# EAGLE design demo (EAGLE 6.5.0)
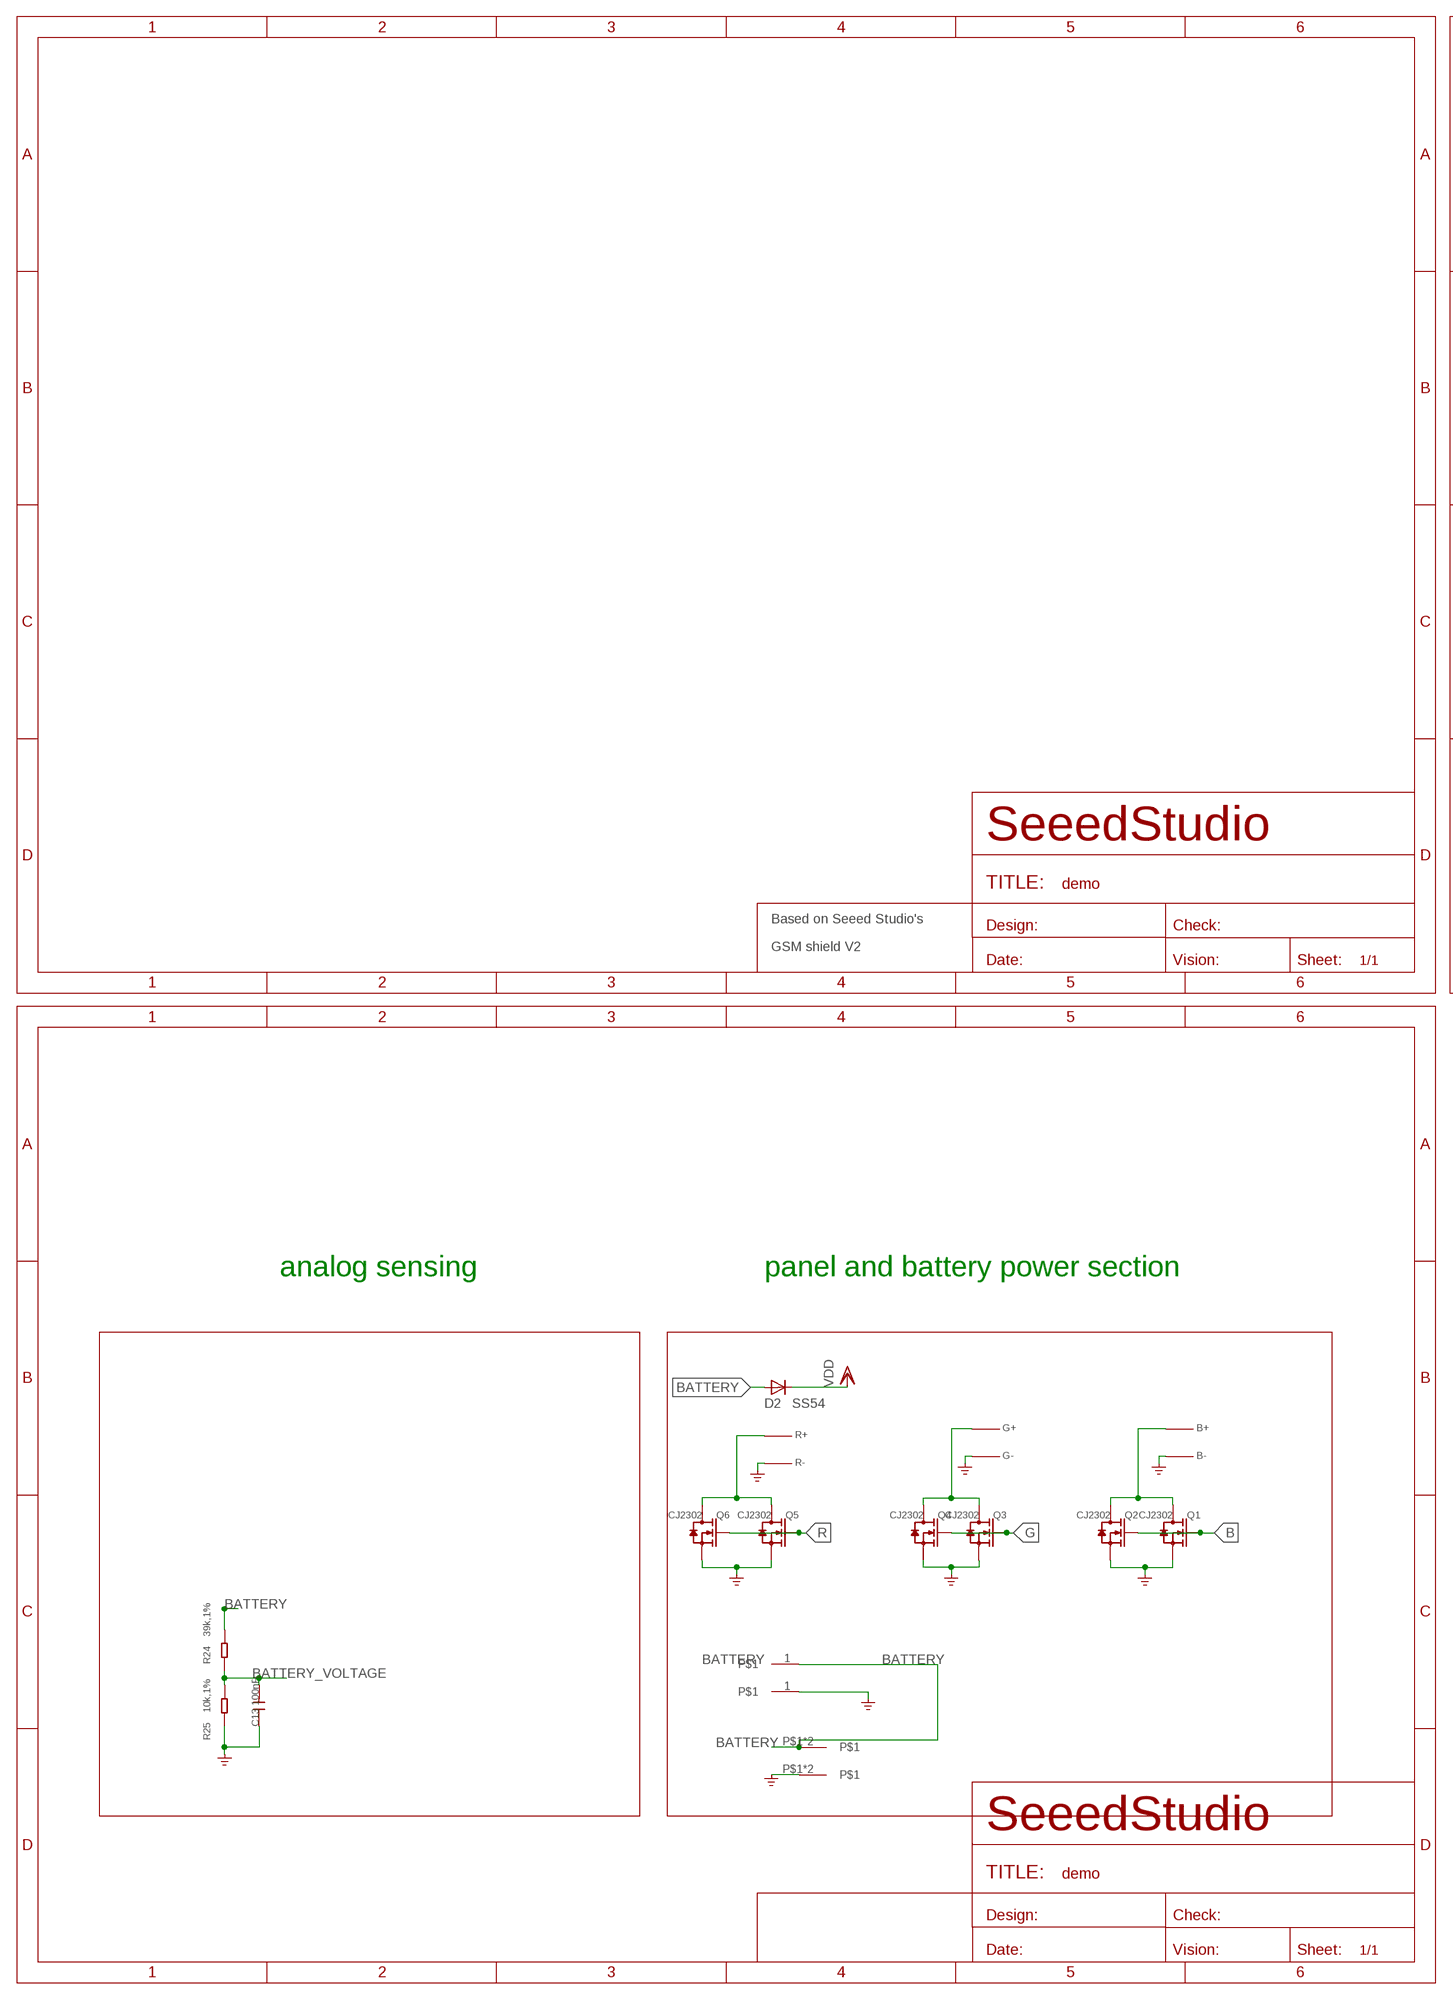
[diagram p0: schematic, sheet 1, part 1 of 2]
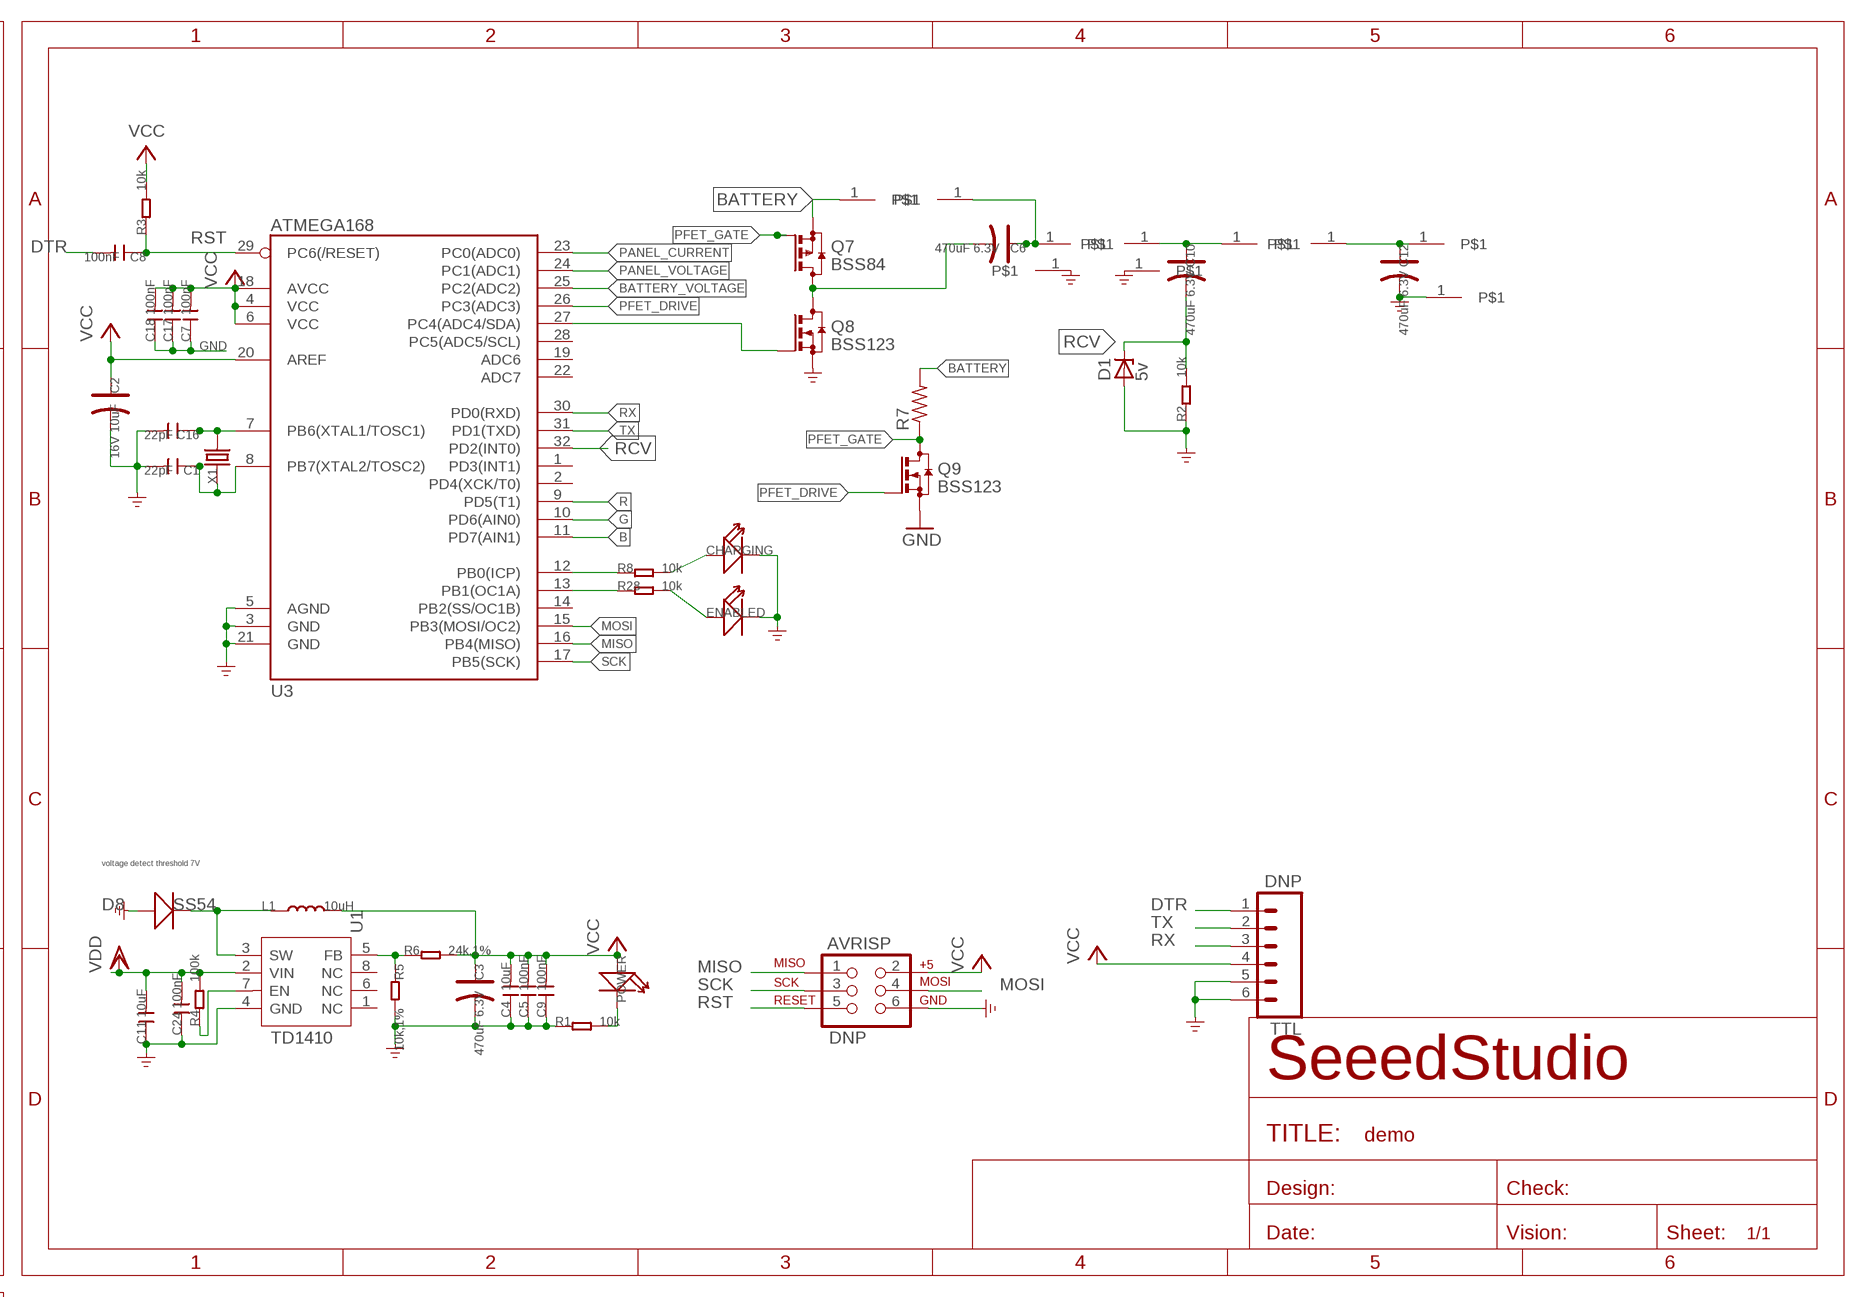
[diagram p1: schematic, sheet 1, part 2 of 2]

## Parts
AVRISP  DNP  AVR_SPI_PRG_62X3_LOCK  [2X3_LOCK]
B+  TINYPIPES_BATTSBATT  [TINYPIPES_SBATT]
B-  TINYPIPES_BATTSBATT  [TINYPIPES_SBATT]
BATTERY+  TINYPIPES_BATTBATT  [TINYPIPES_BATT]
BATTERY-  TINYPIPES_BATTBATT  [TINYPIPES_BATT]
C1  22pF  C-0603  [C0603]
C2  16V 10uF  CAP-AVX-A  [AVX-A]
C3  470uF 6.3V  CAP-AVX-D  [AVX-D]
C4  10uF  C-0805  [C0805]
C5  100nF  C-0603  [C0603]
C6  470uF 6.3V  CAP-AVX-D  [AVX-D]
C7  100nF  C-0603  [C0603]
C8  100nF  C-0603  [C0603]
C9  100nF  C-0603  [C0603]
C10  470uF 6.3V  CAP-AVX-D  [AVX-D]
C11  10uF  C-0805  [C0805]
C12  470uF 6.3V  CAP-AVX-D  [AVX-D]
C13  100nF  C-0603  [C0603]
C16  22pF  C-0603  [C0603]
C17  100nF  C-0603  [C0603]
C18  100nF  C-0603  [C0603]
C24  100nF  C-0603  [C0603]
CHARGING  LED'0603'  [LED-0603]
D1  5v  ZENER-DIODESOD80C  [SOD80C]
D2  SS54  DIODE-SMB  [SMB]
D8  SS54  D'MBRS240LT3'  [SMB]
ENABLED  LED'0603'  [LED-0603]
G+  TINYPIPES_BATTSBATT  [TINYPIPES_SBATT]
G-  TINYPIPES_BATTSBATT  [TINYPIPES_SBATT]
IN+  TINYPIPES_BATTBATT  [TINYPIPES_BATT]
IN-  TINYPIPES_BATTBATT  [TINYPIPES_BATT]
L1  10uH  L'0630'  [L0630]
L1+  TINYPIPES_BATTBATT  [TINYPIPES_BATT]
L1-  TINYPIPES_BATTBATT  [TINYPIPES_BATT]
L2+  TINYPIPES_BATTBATT  [TINYPIPES_BATT]
L2-  TINYPIPES_BATTBATT  [TINYPIPES_BATT]
LOAD+  TINYPIPES_BATTBATT  [TINYPIPES_BATT]
LOAD-  TINYPIPES_BATTBATT  [TINYPIPES_BATT]
OUT+  TINYPIPES_BATTBATT  [TINYPIPES_BATT]
OUT-  TINYPIPES_BATTBATT  [TINYPIPES_BATT]
PANEL+  TINYPIPES_BATTPANEL  [TINYPIPES_PANEL]
PANEL-  TINYPIPES_BATTPANEL  [TINYPIPES_PANEL]
POWER  LED'0603'  [LED-0603]
Q1  CJ2302  MOSFET-N'SOT23'  [SOT23]
Q2  CJ2302  MOSFET-N'SOT23'  [SOT23]
Q3  CJ2302  MOSFET-N'SOT23'  [SOT23]
Q4  CJ2302  MOSFET-N'SOT23'  [SOT23]
Q5  CJ2302  MOSFET-N'SOT23'  [SOT23]
Q6  CJ2302  MOSFET-N'SOT23'  [SOT23]
Q7  BSS84  [SOT23]
Q8  BSS123  [SOT23]
Q9  BSS123  [SOT23]
R1  10k  R-0603  [R0603]
R2  10k  R-0603  [R0603]
R3  10k  R-0603  [R0603]
R4  100k  R-0603  [R0603]
R5  10k,1%  R-0603  [R0603]
R6  24k,1%  R-0603  [R0603]
R7  R-US_R0603  [R0603]
R8  10k  R-0603  [R0603]
R24  39k,1%  R-0603  [R0603]
R25  10k,1%  R-0603  [R0603]
R28  10k  R-0603  [R0603]
R+  TINYPIPES_BATTSBATT  [TINYPIPES_SBATT]
R-  TINYPIPES_BATTSBATT  [TINYPIPES_SBATT]
TTL  DNP  M06LOCK  [1X06_LOCK]
U1  TD1410  [SOP8]
U3  ATMEGA168  [TQFP32-08]
X1  CRYSTAL'5032'  [2P-SMD-5X3.2]

## Nets
B: Q1.1(G) Q2.1(G) U3.11(PD7(AIN1))
BATTERY [power]: BATTERY+.1 D2.A L1+.1 PANEL+.P$1 PANEL+.P$2 Q7.2(S) R7.2 R24.2
BATTERY1 [power]: C10.+ IN+.1 L2+.1
BATTERY_VOLTAGE: C13.2 R24.1 R25.2 U3.25(PC2(ADC2))
DTR: C8.2 TTL.1
G: Q3.1(G) Q4.1(G) U3.10(PD6(AIN0))
GND: AVRISP.6 B-.P$1 BATTERY-.1 C1.2 C2.- C3.- C4.1 C5.1 C7.1 C9.1 C11.1 C12.- C13.1 C16.2 C17.1 C18.1 C24.1 CHARGING.- D1.A D8.+ ENABLED.- G-.P$1 IN-.1 LOAD-.1 OUT-.1 PANEL-.P$1 PANEL-.P$2 Q1.2(S) Q2.2(S) Q3.2(S) Q4.2(S) Q5.2(S) Q6.2(S) Q8.2(S) Q9.2(S) R1.1 R2.1 R5.2 R25.1 R-.P$1 TTL.5 TTL.6 U1.4(GND) U3.3(GND) U3.5(AGND) U3.21(GND)
MISO: AVRISP.1 U3.16(PB4(MISO))
MOSI: AVRISP.4 U3.15(PB3(MOSI/OC2))
N$1: C6.- Q7.3(D) Q8.3(D)
N$2: C16.1 U3.7(PB6(XTAL1/TOSC1)) X1.2
N$3: B+.P$1 Q1.3(D) Q2.3(D)
N$4: Q8.1(G) U3.27(PC4(ADC4/SDA))
N$6: G+.P$1 Q3.3(D) Q4.3(D)
N$7: Q5.3(D) Q6.3(D) R+.P$1
N$8: C6.+ L1-.1 OUT+.1
N$9: POWER.- R1.2
N$10 [power]: R8.1 U3.12(PB0(ICP))
N$12: R4.1 U1.7(EN)
N$13: C1.1 U3.8(PB7(XTAL2/TOSC2)) X1.1
N$14 [power]: R28.1 U3.13(PB1(OC1A))
N$15: C12.+ L2-.1 LOAD+.1
N$18: CHARGING.+ R8.2
N$24: ENABLED.+ R28.2
N$38: D8.- L1.1 U1.3(SW)
N$47: R5.1 R6.1 U1.5(FB)
PANEL_CURRENT: U3.23(PC0(ADC0))
PANEL_VOLTAGE: U3.24(PC1(ADC1))
PFET_DRIVE: Q9.1(G) U3.26(PC3(ADC3))
PFET_GATE: Q7.1(G) Q9.3(D) R7.1
R: Q5.1(G) Q6.1(G) U3.9(PD5(T1))
RCV: C10.- D1.C R2.2 U3.32(PD2(INT0))
RST: AVRISP.5 C8.1 R3.1 U3.29(PC6(/RESET))
RX: TTL.3 U3.30(PD0(RXD))
SCK: AVRISP.3 U3.17(PB5(SCK))
TX: TTL.2 U3.31(PD1(TXD))
VCC: AVRISP.2 C2.+ C3.+ C4.2 C5.2 C7.2 C9.2 C17.2 C18.2 L1.2 POWER.+ R3.2 R6.2 TTL.4 U3.4(VCC) U3.6(VCC) U3.18(AVCC) U3.20(AREF)
VDD: C11.2 C24.2 D2.C R4.2 U1.2(VIN)
Unconnected: U1.1(NC) U1.6(NC) U1.8(NC) U3.1(PD3(INT1)) U3.2(PD4(XCK/T0)) U3.14(PB2(SS/OC1B)) U3.19(ADC6) U3.22(ADC7) U3.28(PC5(ADC5/SCL))

## Notes on the sheet
- voltage detect threshold 7V
- Based on Seeed Studio's
- GSM shield V2
- analog sensing | panel and battery power section

## Library data of the parts
AVRISP = SparkFun:AVR_SPI_PRG_6: AVR ISP 6 Pin This is the reduced ISP connector for AVR programming. Common on Arduino. This footprint will take up less PCB space and can be used with a 10-pin to 6-pin adapter such as SKU: BOB-08508
B+ B- G+ G- R+ R- = demo:TINYPIPES_BATT
BATTERY+ BATTERY- IN+ IN- L1+ L1- L2+ L2- LOAD+ LOAD- OUT+ OUT- PANEL+ PANEL- = tinyPipes_v2.5:TINYPIPES_BATT
C1 C4 C5 C7-C9 C11 C13 C16-C18 C24 = Discrete:C*: Ceramic Capacitors
C2 C3 C6 C10 C12 = Discrete:CAP*: Electrolytic Capacitors,Tantalum Capacitors and Super Capacitors
CHARGING ENABLED POWER = Discrete:LED*
D1 = diode:ZENER-DIODE: Z-Diode
D2 = diode:DIODE-: DIODE
D8 = Discrete:D*
L1 = Discrete:L*
Q1-Q6 = Discrete:MOSFET-N: IRLL014: http://www.vishay.com/docs/91319/sihll014.pdf
Q7 = transistor-small-signal:BSS84: P-CHANNEL MOS FET
Q8 Q9 = transistor-small-signal:BSS123: N-CHANNEL MOS FET
R1-R6 R8 R24 R25 R28 = Discrete:R*
R7 = rcl:R-US_: RESISTOR, American symbol
TTL = SparkFun-Connectors:M06: Header 6 Standard 6-pin 0.1" header. Use with straight break away headers (SKU : PRT-00116), right angle break away headers (PRT-00553), swiss pins (PRT-00743), machine pins (PRT-00117), and female headers (PRT-00115). Molex polarized connector foot print use with SKU : PRT-08094 with associated crimp pins and housings. NOTES ON THE VARIANTS LOCK and LOCK_LONGPADS... This footprint was designed to help hold the alignment of a through-hole component (i.e. 6-pin header) while soldering it into place. You may notice that each hole has been shifted either up or down by 0.005 of an inch from it's more standard position (which is a perfectly straight line). This slight alteration caused the pins (the squares in the middle) to touch the edges of the holes. Because they are alternating, it causes a "brace" to hold the component in place. 0.005 has proven to be the perfect amount of "off-center" position when using our standard breakaway headers. Although looks a little odd when you look at the bare footprint, once you have a header in there, the alteration is very hard to notice. Also,if you push a header all the way into place, it is covered up entirely on the bottom side. This idea of altering the position of holes to aid alignment will be further integrated into the Sparkfun Library for other footprints. It can help hold any component with 3 or more connection pins.
U1 = template:TD1410: 2A 380KHz 20V PWM Buck DC/DC Converter
U3 = SparkFun:ATMEGA168
X1 = Discrete:CRYSTAL*: CRYSTAL

## Board
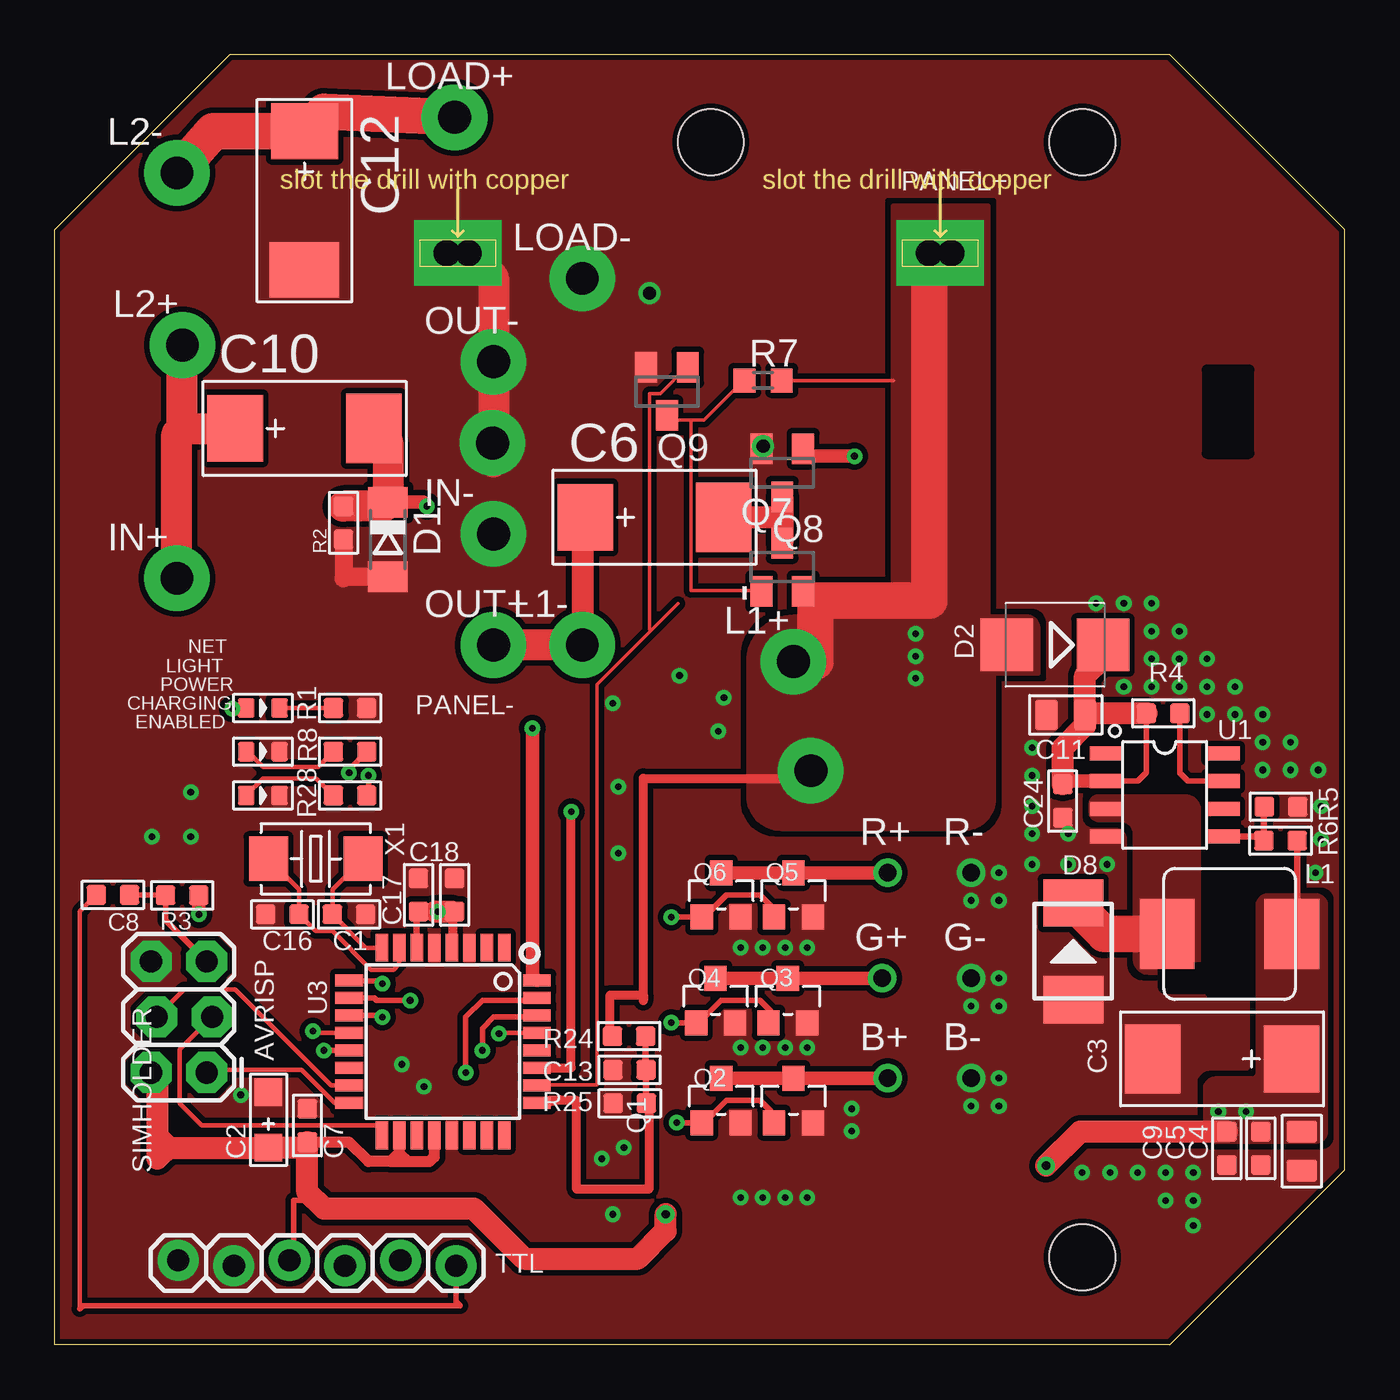
[diagram p2: board, top side]
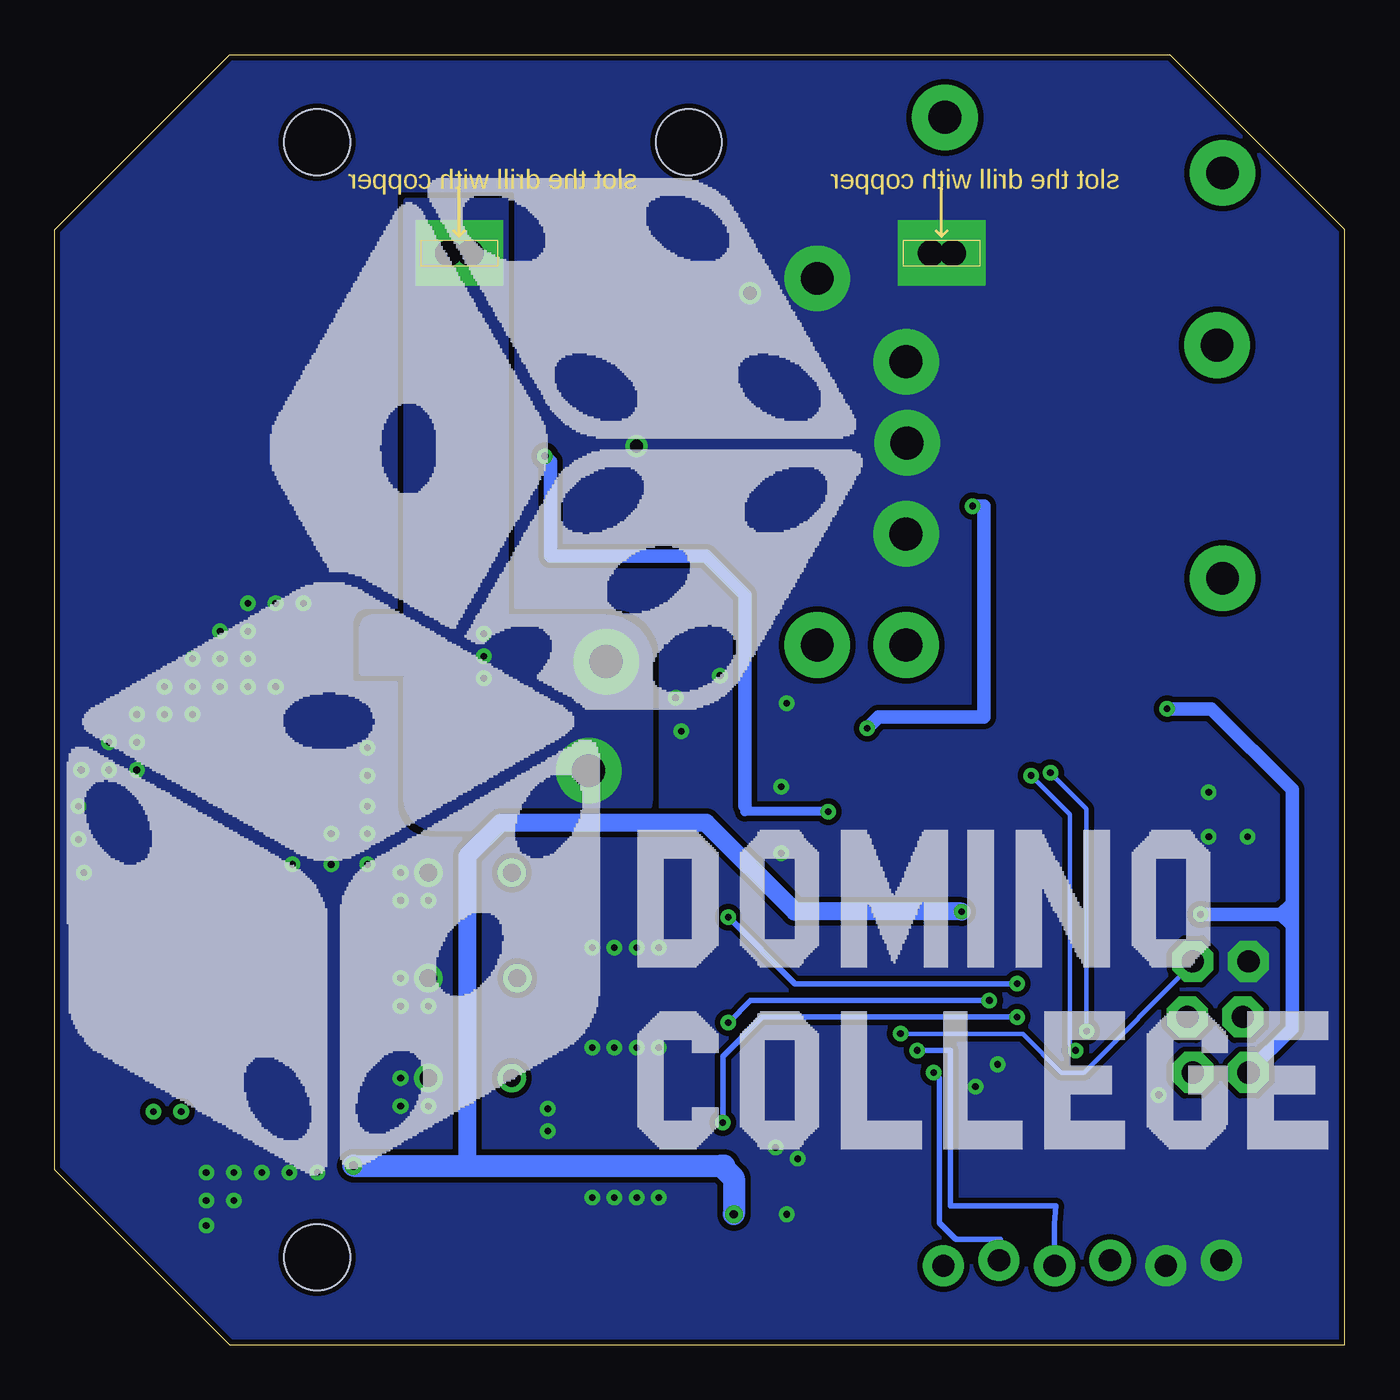
[diagram p3: board, bottom side, seen from below]

Size 59 x 59 mm. Coordinates in mm from the lower left corner, seen from the top.
Outline: 51,0 0,0 0,51 8,59 51,59 59,51 59,8 51,0
Copper layers (1*16): Top 0.035mm / dielectric 1.5mm / Bottom 0.035mm
Design rules "default *": minimum track width 6mil, minimum drill 12mil, track to track 6mil, track to pad 6mil, pad to pad 6mil, via to via 6mil, smd to smd 0mil, copper to edge 10mil, drill to drill 8mil, minimum pad ring 10mil, minimum via ring 8mil, stop-mask expansion 4mil, vias tented up to drill 0.7mm, thermal gap 10mil
Holes 3 mm at 47,4 47,55 30,55
tRestrict: area 52.7,40.8 to 54.6,44.6; 8 lines

### Footprints (pad centres in the part's own frame; a part is rotated, then mirrored left to right if it is on the bottom)
2X3_LOCK = drill 1.016 pad 1.88 octagon: 1 0,0; 2 0,2.54; 3 2.54,-0.254; 4 2.54,2.286; 5 5.08,0; 6 5.08,2.54
TINYPIPES_SBATT = drill 0.8: P$1 0,0
TINYPIPES_BATT = drill 1.5 pad 3: 1 0,0
C0603 = smd 0.889 x 0.889: 1 -0.762,0; 2 0.762,0
AVX-A = smd 1.27 x 1.27: + -1.27,0; - 1.27,0
AVX-D = smd 2.54 x 3.048: + -3.175,0 | smd 2.54 x 3.175: - 3.175,0
C0805 = smd 1.016 x 1.397: 1 -0.889,0; 2 0.889,0
LED-0603 = smd 0.762 x 0.889: + -0.762,0; - 0.762,0
SOD80C = smd 1.4 x 1.8: A 1.7,0; C -1.7,0
SMB = smd 2.4 x 2.4: A 2.2,0; C -2.2,0
SMB' = smd 2.159 x 2.743: + -2.21,0; - 2.21,0
L0630 = smd 2.5 x 3.2: 1 -2.85,0; 2 2.85,0
TINYPIPES_PANEL = drill 1.2 pad 3 square: P$1 -0.492,0; P$2 0.508,0
SOT23 = smd 1.016 x 1.143: 1 -0.889,-1.016; 2 0.889,-1.016; 3 0,1.016
SOT23' = smd 1 x 1.4: 1 -0.95,-1.1; 2 0.95,-1.1; 3 0,1.1
R0603 = smd 0.889 x 0.889: 1 -0.762,0; 2 0.762,0
R0603' = smd 1 x 1.1: 1 -0.85,0; 2 0.85,0
1X06_LOCK = drill 1.016 pad 1.88: 1 0,0; 2 2.54,-0.254; 3 5.08,0; 4 7.62,-0.254; 5 10.16,0; 6 12.7,-0.254
SOP8 = smd 0.635 x 1.524: 1 -1.905,-2.667; 2 -0.635,-2.667; 3 0.635,-2.667; 4 1.905,-2.667; 5 1.905,2.667; 6 0.635,2.667; 7 -0.635,2.667; 8 -1.905,2.667
TQFP32-08 = smd 1.27 x 0.559: 1 -4.293,2.8; 2 -4.293,2; 3 -4.293,1.2; 4 -4.293,0.4; 5 -4.293,-0.4; 6 -4.293,-1.2; 7 -4.293,-2; 8 -4.293,-2.8; 17 4.293,-2.8; 18 4.293,-2; 19 4.293,-1.2; 20 4.293,-0.4; 21 4.293,0.4; 22 4.293,1.2; 23 4.293,2; 24 4.293,2.8 | smd 0.559 x 1.27: 9 -2.8,-4.293; 10 -2,-4.293; 11 -1.2,-4.293; 12 -0.4,-4.293; 13 0.4,-4.293; 14 1.2,-4.293; 15 2,-4.293; 16 2.8,-4.293; 25 2.8,4.293; 26 2,4.293; 27 1.2,4.293; 28 0.4,4.293; 29 -0.4,4.293; 30 -1.2,4.293; 31 -2,4.293; 32 -2.8,4.293
2P-SMD-5X3.2 = smd 1.778 x 2.032: 1 -2.159,0; 2 2.159,0

### Placement (x,y rotation side)
AVRISP  6.95,12.45 90 top
B+  38.1,12.19 0 top
B-  41.91,12.19 0 top
BATTERY+  34.58,26.26 180 top
BATTERY-  20.02,41.24 180 top
C1  13.46,19.68 0 top
C2  9.78,10.29 90 top
C3  53.39,13.08 180 top
C4  57.03,8.86 90 top
C5  55.16,8.99 90 top
C6  27.43,37.85 0 top
C7  11.56,10.03 270 top
C8  2.67,20.57 180 top
C9  53.6,8.99 90 top
C10  11.43,41.91 0 top
C11  46.24,28.81 0 top
C12  11.43,52.32 270 top
C13  26.29,12.57 0 top
C16  10.41,19.68 180 top
C17  16.64,20.57 270 top
C18  18.29,20.57 270 top
C24  46.1,24.87 90 top
CHARGING  9.53,27.12 0 top
D1  [SOD80C]  15.24,36.83 270 top
D2  45.74,32.01 180 top
D8  SS54  [SMB']  46.58,18 90 top
ENABLED  9.53,25.12 0 top
G+  37.85,16.76 0 top
G-  41.91,16.76 0 top
IN+  5.59,35.05 0 top
IN-  20.07,37.08 0 top
L1  53.73,18.79 0 top
L1+  33.78,31.24 0 top
L1-  24.13,32 0 top
L2+  5.84,45.72 0 top
L2-  5.59,53.59 0 top
LOAD+  18.29,56.13 0 top
LOAD-  24.13,48.77 0 top
OUT+  20.07,32 0 top
OUT-  20.07,44.96 0 top
PANEL+  40.5,49.93 180 top
PANEL-  18.44,49.93 180 top
POWER  9.53,29.12 0 top
Q1  33.78,11.18 0 top
Q2  30.48,11.18 0 top
Q3  33.53,15.75 0 top
Q4  30.23,15.75 0 top
Q5  33.78,20.57 0 top
Q6  30.48,20.57 0 top
Q7  BSS84  [SOT23']  33.27,35.56 0 top
Q8  BSS123  [SOT23']  33.27,39.88 180 top
Q9  BSS123  [SOT23']  28,43.6 180 top
R1  13.51,29.12 180 top
R2  13.21,37.59 90 top
R3  5.83,20.55 0 top
R4  50.69,28.88 180 top
R5  56.08,24.61 0 top
R6  56.06,23.05 0 top
R7  [R0603']  32.4,44.1 0 top
R8  13.51,27.12 180 top
R24  26.27,14.11 180 top
R25  26.3,11.05 0 top
R28  13.51,25.12 180 top
R+  38.1,21.59 0 top
R-  41.91,21.59 0 top
TTL  18.35,3.62 180 top
U1  50.76,25.14 270 top
U3  17.76,13.87 270 top
X1  11.94,22.23 180 top

### Tracks (layer width: path | path; a pad name or v marks a point on that pad's centre or on a via)
B  (via drill 0.3)
  Top 0.254: Q1.1 32.77,10.29 32.77,10.67 32.26,11.18 30.73,11.18 29.72,10.16 Q2.1 v28.45,10.16 | U3.11 14.9,15.07 v14.99,14.99
  Bottom 0.254: v14.99,14.99 26.65,14.99 28.45,13.19 v28.45,10.16
BATTERY  (via drill 0.3)
  Top 0.152: 38.35,44.1 R7.2
  Top 0.254: 34.58,25.91 BATTERY+.1 | 34.8,34.04 34.22,34.04 Q7.2
  Top 0.406: 34.58,25.91 26.92,25.91 26.92,16 | R24.2 25.4,14.11 25.4,16 26.92,16 | 26.92,16 26.92,15.75
  Top 1.676: L1+.1 34.8,31.24 34.8,34.04 40,34.04 PANEL+.P$2
  Top 2.032: 43.49,32.06 D2.A
  other vias: 39.37,32.51 39.37,31.5 39.37,30.48
  pour Top (isolate 0.254, no thermals): 31.75,25.1 31.75,31.23 arc-90 33.8,33.27 38.35,33.27 38.35,52.07 42.67,52.07 42.67,33.27 44.45,33.27 arc-90 44.96,32.77 44.96,30.73 42.93,30.73 42.93,24.99 arc-90 41.56,23.62 33.23,23.62 arc-90
  pour Bottom (isolate 0.254, no thermals): 31.75,25.1 31.75,31.23 arc-90 33.8,33.27 38.35,33.27 38.35,52.32 42.93,52.32 42.93,33.27 44.45,33.27 arc-90 44.96,32.77 44.96,30.73 42.93,30.73 42.93,24.99 arc-90 41.56,23.62 33.23,23.62 arc-90
BATTERY1
  Top 1.422: IN+.1 5.59,41.66 5.84,41.91 | 5.84,41.91 C10.+ | 5.84,41.91 L2+.1
BATTERY_VOLTAGE
  Top 0.254: U3.25 22.61,11.07 22.88,11.07 23.11,11.3
  Top 0.305: R24.1 27.03,12.6 C13.2 R25.2
  Top 0.406: R25.2 27.18,10.93 27.18,7.11 23.88,7.11 23.88,11.18 22.61,11.18 22.61,11.07
DTR
  Top 0.203: C8.2 1.14,19.81 1.14,1.65
  Top 0.254: 1.14,1.65 1.27,1.78 18.54,1.78 18.35,1.97 TTL.1
G  (via drill 0.3)
  Top 0.254: Q3.1 32.77,14.86 32.77,15.24 32.26,15.75 30.48,15.75 29.46,14.73 Q4.1 v28.19,14.73 | U3.10 14.61,15.87 14.73,15.75 v16.26,15.75
  Bottom 0.254: v16.26,15.75 27.18,15.75 v28.19,14.73
GND  (via drill 0.3 pad 0.64, 0.6)
  Top 0.813: R2.1 13.21,35.05 13.29,35.13 D1.A
  Top 1.422: PANEL-.P$1 20.07,48.79 20.07,40.39 20.02,40.43 BATTERY-.1
  other vias: 25.53,5.97 25.02,8.51 26.04,9.02 15.88,12.83 16.89,11.81 6.22,25.27 6.22,23.24 4.45,23.24 47.62,33.91 48.9,33.91 50.16,33.91 51.44,32.64 50.16,32.64 50.16,31.37 51.44,31.37 52.7,31.37 50.16,30.1 51.44,30.1 48.9,30.1 52.7,30.1 52.7,28.83 53.98,28.83 53.98,30.1 55.24,28.83 55.24,27.56 55.24,26.29 56.52,26.29 56.52,27.56 44.7,27.3 44.7,26.04 44.7,24.64 44.7,23.37 44.7,21.97 46.35,21.97 46.35,23.37 48.13,21.97 52.07,7.87 52.07,5.46 52.07,6.6 57.91,24.64 57.78,26.29 57.91,23.11 57.66,21.59 8.51,11.43 46.99,7.87 48.26,7.87 50.8,7.87 50.8,6.6 49.53,7.87 31.37,18.16 34.42,18.16 34.42,13.59 31.37,13.59 31.37,6.73 34.42,6.73 32.38,13.59 33.4,13.59 32.38,18.16 33.4,18.16 32.38,6.73 33.4,6.73 36.45,10.79 36.45,9.78 41.91,10.92 43.18,10.92 43.18,12.19 41.91,20.32 43.18,20.32 43.18,21.59 41.91,15.49 43.18,15.49 43.18,16.76 30.61,29.59 30.35,28.07 25.53,29.34 25.78,25.53 25.78,22.48 28.57,30.61 32.4,41.1 27.2,48.1
  pour Top (isolate 0.254, rank 6, no thermals): 0,59.05 59.05,59.05 59.05,0 0,0
  pour Bottom (isolate 0.254, rank 6, no thermals): 0,59.05 59.05,59.05 59.05,0 0,0
MISO
  Top 0.203: U3.16 12.81,11.07 11.3,12.58 7.07,12.58 AVRISP.1
MOSI
  Top 0.203: AVRISP.4 5.92,16.26 8.26,16.26 12.64,11.87 U3.15
N$1
  Top 1.016: Q8.3 33.27,37.85 | 33.27,37.85 Q7.3 | C6.- 33.27,37.85
N$2
  Top 0.203: U3.7 15.76,17.41 15.49,17.14 14.48,17.14 12.7,18.92 11.94,18.92 C16.1 11.18,20.83 X1.2
N$3
  Top 0.61: Q2.3 Q1.3 B+.P$1
N$4  (via drill 0.3)
  Top 0.406: U3.27 23.62,12.67 v23.62,24.38
  Top 0.61: Q8.1 34.56,40.64 v36.58,40.64
  Bottom 0.406: v23.62,24.38 27.43,24.38 27.43,24.64
  Bottom 0.61: v36.58,40.64 36.32,40.39 36.32,36.07 29.21,36.07 27.43,34.29 27.43,24.64
N$6
  Top 0.61: Q4.3 Q3.3 G+.P$1
N$7
  Top 0.61: Q6.3 Q5.3 R+.P$1
N$8
  Top 1.016: C6.+ 24.13,37.72 L1-.1
  Top 1.422: L1-.1 OUT+.1
N$9
  Top 0.203: POWER.- R1.2
N$10  (via drill 0.3 pad 0.64)
  Top 0.203: U3.12 11.89,14.27 v11.81,14.35 | 14.22,27.17 R8.1
  Top 0.254: v13.46,26.16 13.46,26.32 R8.1
  Bottom 0.203: v11.81,14.35 11.81,24.51 v13.46,26.16
N$12
  Top 0.254: R4.1 51.46,26.14 51.82,25.78 U1.7
N$13
  Top 0.203: U3.8 14.22,18.16 C1.1 12.7,20.83 X1.1
N$14  (via drill 0.3 pad 0.64)
  Top 0.203: 14.22,25.17 R28.1
  Top 0.254: v14.35,26.04 14.35,25.2 R28.1 | U3.13 v12.32,13.47 v12.32,13.46
  Bottom 0.203: v12.32,13.46 12.57,13.72 12.57,24.26 v14.35,26.04
N$15
  Top 1.676: L2-.1 7.24,55.5 C12.+ 12.32,56.39 LOAD+.1
N$18
  Top 0.203: CHARGING.+ 8.82,27.12 9.53,26.42 12.04,26.42 R8.2
N$24
  Top 0.203: ENABLED.+ 8.76,25.15 9.53,25.91 11.96,25.91 R28.2
N$38
  Top 1.676: L1.1 48,18.79 D8.-
  pour Top (isolate 0.254, no thermals): 51.69,17.02 50.04,17.02 arc-90 49.4,17.65 49.4,23.37 arc90 48.77,24 47.75,24 arc-90 47.37,24.38 47.37,24.7 arc-90 47.75,25.08 51.69,25.08 arc-90 52.32,24.45 52.32,17.65 arc-90
N$47
  Top 0.305: U1.5 55.11,23.24 R6.1 55.3,24.59 R5.1
PFET_DRIVE
  Top 0.152: 28.5,33.9 27.25,32.65 | 27.25,32.65 24.8,30.2 24.8,11.9 22.1,11.9 U3.26 | Q9.1 28.9,44.7 27.7,43.5 27.2,43.5 27.2,32.7 27.25,32.65
PFET_GATE
  Top 0.152: Q7.1 32.3,34.5 29.1,34.5 29.1,42.3 | 29.1,42.3 28,42.3 Q9.3 | 29.1,42.3 29.7,42.3 31.5,44.1 R7.1
R  (via drill 0.3)
  Top 0.203: 13.5,16.64 U3.9
  Top 0.254: Q5.1 32.77,19.68 32.77,20.07 32.26,20.57 30.73,20.57 29.72,19.56 Q6.1 v28.19,19.56 | 13.5,16.64 14.86,16.64 v14.99,16.51
  Bottom 0.254: v14.99,16.51 25.15,16.51 v28.19,19.56
RCV  (via drill 0.3)
  Top 0.61: U3.32 21.84,16.88 v21.84,28.19 | v17.02,38.35 16.84,38.53 D1.C
  Top 1.422: C10.- 15.24,41.27 D1.C 15.06,38.35 R2.2
  Bottom 0.61: v21.84,28.19 21.34,28.7 16.51,28.7 16.51,38.35 v17.02,38.35
RST  (via drill 0.3)
  Top 0.203: U3.29 20.36,14.27 v20.32,14.22
  Top 0.254: C8.1 5.05,20.57 R3.1 5.07,19.41 AVRISP.5
  Bottom 0.203: v20.32,14.22 14.73,14.22 12.95,12.45 11.94,12.45 6.95,17.44 AVRISP.5
RX  (via drill 0.3)
  Top 0.254: U3.30 21.97,14.99 20.07,14.99 19.56,14.48 v19.56,13.46
  Bottom 0.254: v19.56,13.46 18.03,13.46 18.03,6.35 13.21,6.35 13.27,5.52 TTL.3
SCK
  Top 0.203: U3.17 14.96,9.78 | 14.96,9.78 14.96,9.93 | AVRISP.3 5.71,13.51 5.71,11.05 6.73,10.03 14.7,10.03 14.96,9.78
TX  (via drill 0.3)
  Top 0.254: U3.31 21.93,15.75 19.56,15.75 18.8,14.99 v18.8,12.45
  Bottom 0.254: v18.8,12.45 18.54,12.19 18.54,5.59 17.78,4.83 15.75,4.83 15.81,4.76 TTL.2
VCC  (via drill 0.3, 0.3 pad 0.64, 0.38 pad 0.81)
  Top 0.254: U3.4 18.29,18.16 C18.2 v17.53,19.81 | TTL.4 10.92,3.87 10.92,6.6 11.56,6.6 11.56,6.99
  Top 0.305: U3.6 16.56,19.81 C17.2 17.4,19.81 | R6.2 56.82,19.04 L1.2 | 18.16,19.81 C18.2 18.16,19.68 U3.4
  Top 0.508: U3.18 15.76,8.77 | 15.76,8.77 15.37,8.38 | 15.37,8.38 14.35,8.38 13.46,9.27 C7.2 | 15.37,8.38 16.13,8.38 | 16.13,8.38 17.14,8.38 17.36,8.6 U3.20 | 9.91,9.27 9.65,9.02 C2.+ | 15.76,8.77 15.76,8.75 16.13,8.38
  Top 0.61: v8.13,29.08 8.72,29.08 POWER.+ | R3.2 6.59,19.7 v6.6,19.68
  Top 1.016: 17.4,19.81 v17.53,19.81 18.16,19.81 | 5.08,9.02 5.21,9.02 | 5.21,9.02 9.65,9.02 11.56,9.02 | AVRISP.2 4.44,12.45 4.7,12.19 4.7,9.53 | 4.7,9.53 4.7,8.51 5.21,9.02 | 5.21,9.02 4.7,9.53 | 11.56,9.02 11.56,6.99 12.32,6.22 19.18,6.22 21.46,3.94 26.67,3.94 27.94,5.21 v27.94,5.97 | C7.2 11.56,9.02 | C9.2 46.9,9.75 v45.34,8.19
  Bottom 0.61: AVRISP.2 4.41,12.48 2.41,14.48 2.41,19.18 | 2.41,19.18 2.41,20.19 | 2.41,20.19 2.41,25.4 6.1,29.08 v8.13,29.08 | v6.6,19.68 2.92,19.68 | 2.92,19.68 2.41,20.19 | 2.92,19.68 2.41,19.18
  Bottom 0.813: v17.53,19.81 25.15,19.81 29.21,23.88 38.61,23.88 40.13,22.35 40.13,8.45 39.88,8.19
  Bottom 1.016: v27.94,5.97 27.94,7.62 28.51,8.19 | v45.34,8.19 39.88,8.19 28.51,8.19 | 28.51,8.19 28.38,8.19
  other vias: 53.21,10.67 54.48,10.67
  pour Top (isolate 0.254, no thermals): 52.7,11.68 52.7,9.78 arc90 53.09,9.4 57.66,9.4 arc90 58.04,9.78 58.04,20.07 arc90 57.66,20.45 55.5,20.45 arc90 55.12,20.07 55.12,12.45 arc-90 54.74,12.06 53.09,12.06 arc90
VDD
  Top 0.254: R4.2 49.93,26.18 49.53,25.78 U1.2
  Top 0.61: U1.2 46.25,25.78 C24.2
  Top 1.016: R4.2 47.3,28.88 arc45 C11.2 | C24.2 46.1,27.3 47.12,28.32 47.12,30.61 47.88,31.37 47.88,31.95 D2.C

### Text on the board
tPlace: - | PANEL- | SIMHOLDER
tNames: NET | LIGHT